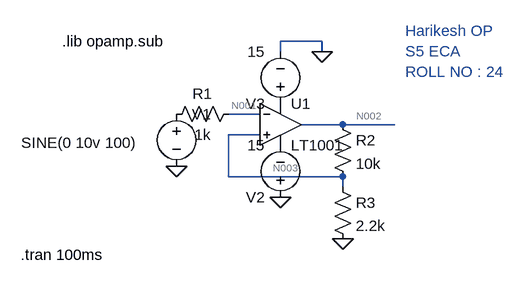
[diagram p0: schematic SCHMIT TRIGGER.asc]
SCHMIT TRIGGER.asc, the LTspice schematic file:
Version 4
SHEET 1 880 680
WIRE 288 16 224 16
WIRE 224 32 224 16
WIRE 288 32 288 16
WIRE 192 128 144 128
WIRE 320 144 256 144
WIRE 400 144 320 144
WIRE 192 160 144 160
WIRE 144 224 144 160
WIRE 320 224 144 224
WIRE 320 240 320 224
FLAG 320 320 0
FLAG 64 208 0
FLAG 288 32 0
FLAG 224 256 0
SYMBOL res 160 112 R90
WINDOW 0 0 56 VBottom 2
WINDOW 3 32 56 VTop 2
SYMATTR InstName R1
SYMATTR Value 1k
SYMBOL res 304 128 R0
SYMATTR InstName R2
SYMATTR Value 10k
SYMBOL res 304 224 R0
SYMATTR InstName R3
SYMATTR Value 2.2k
SYMBOL voltage 64 112 R0
WINDOW 3 -239 60 Left 2
WINDOW 123 0 0 Left 0
WINDOW 39 0 0 Left 0
SYMATTR Value SINE(0 10v 100)
SYMATTR InstName V1
SYMBOL voltage 224 272 R180
WINDOW 123 0 0 Left 0
WINDOW 39 0 0 Left 0
SYMATTR InstName V2
SYMATTR Value 15
SYMBOL voltage 224 128 R180
WINDOW 123 0 0 Left 0
WINDOW 39 0 0 Left 0
SYMATTR InstName V3
SYMATTR Value 15
SYMBOL OpAmps\\LT1001 224 80 R0
SYMATTR InstName U1
TEXT -112 16 Left 2 !.lib opamp.sub
TEXT 416 0 Left 2 ;Harikesh OP\nS5 ECA \nROLL NO : 24
TEXT -176 344 Left 2 !.tran 100ms

The netlist it stands for:
* SCHMIT TRIGGER.asc
R1 N001 P001 1k
R2 N002 N003 10k
R3 N003 0 2.2k
V1 P001 0 SINE(0 10v 100)
V2 0 P002 15
V3 P003 0 15
XU1 N003 N001 P003 P002 N002 LT1001  ; pins In+ In- V+ V- OUT
.lib opamp.sub
* Harikesh OP
* S5 ECA
* ROLL NO : 24
.tran 100ms
.lib LTC.lib
.backanno
.end

* Results of the author's LTspice run, read from the files saved beside the schematic
* Operating Point, zero values left out:
*   V(n001) = 266.4 mV
*   V(n002) = 14.03 V
*   V(n003) = 2.049 V
*   V(p002) = -15 V
*   V(p003) = 15 V
*   I(R1) = 266.4 µA
*   I(R2) = 1.198 mA
*   I(R3) = 931.4 µA
*   I(V1) = 266.4 µA
*   I(V2) = -1.694 mA
*   I(V3) = -2.885 mA
*   Ix(u1:1) = 266.4 µA
*   Ix(u1:2) = -266.4 µA
*   Ix(u1:3) = 2.885 mA
*   Ix(u1:4) = -1.694 mA
*   Ix(u1:5) = -1.198 mA
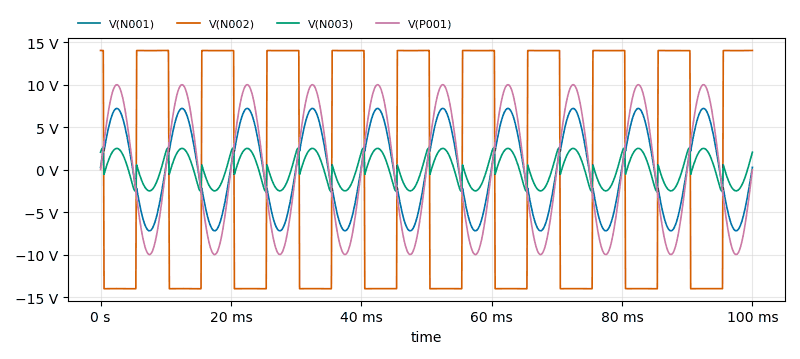
[diagram p1: Transient Analysis of SCHMIT TRIGGER.asc, plotted from the saved traces]
* Transient Analysis, 1 run:
*   V(N001): min -7.204 V, max 7.204 V, average -8.787 µV, rms 5.064 V, last 266.5 mV
*   V(N002): min -14.03 V, max 14.04 V, average -309.8 µV, rms 13.91 V, last 14.03 V
*   V(N003): min -2.53 V, max 2.532 V, average 12.41 µV, rms 1.728 V, last 2.049 V
*   V(P001): min -10 V, max 10 V, average 36.28 µV, rms 7.072 V, last 0 V